# EAGLE schematic mainboard (EAGLE 9.1.1)
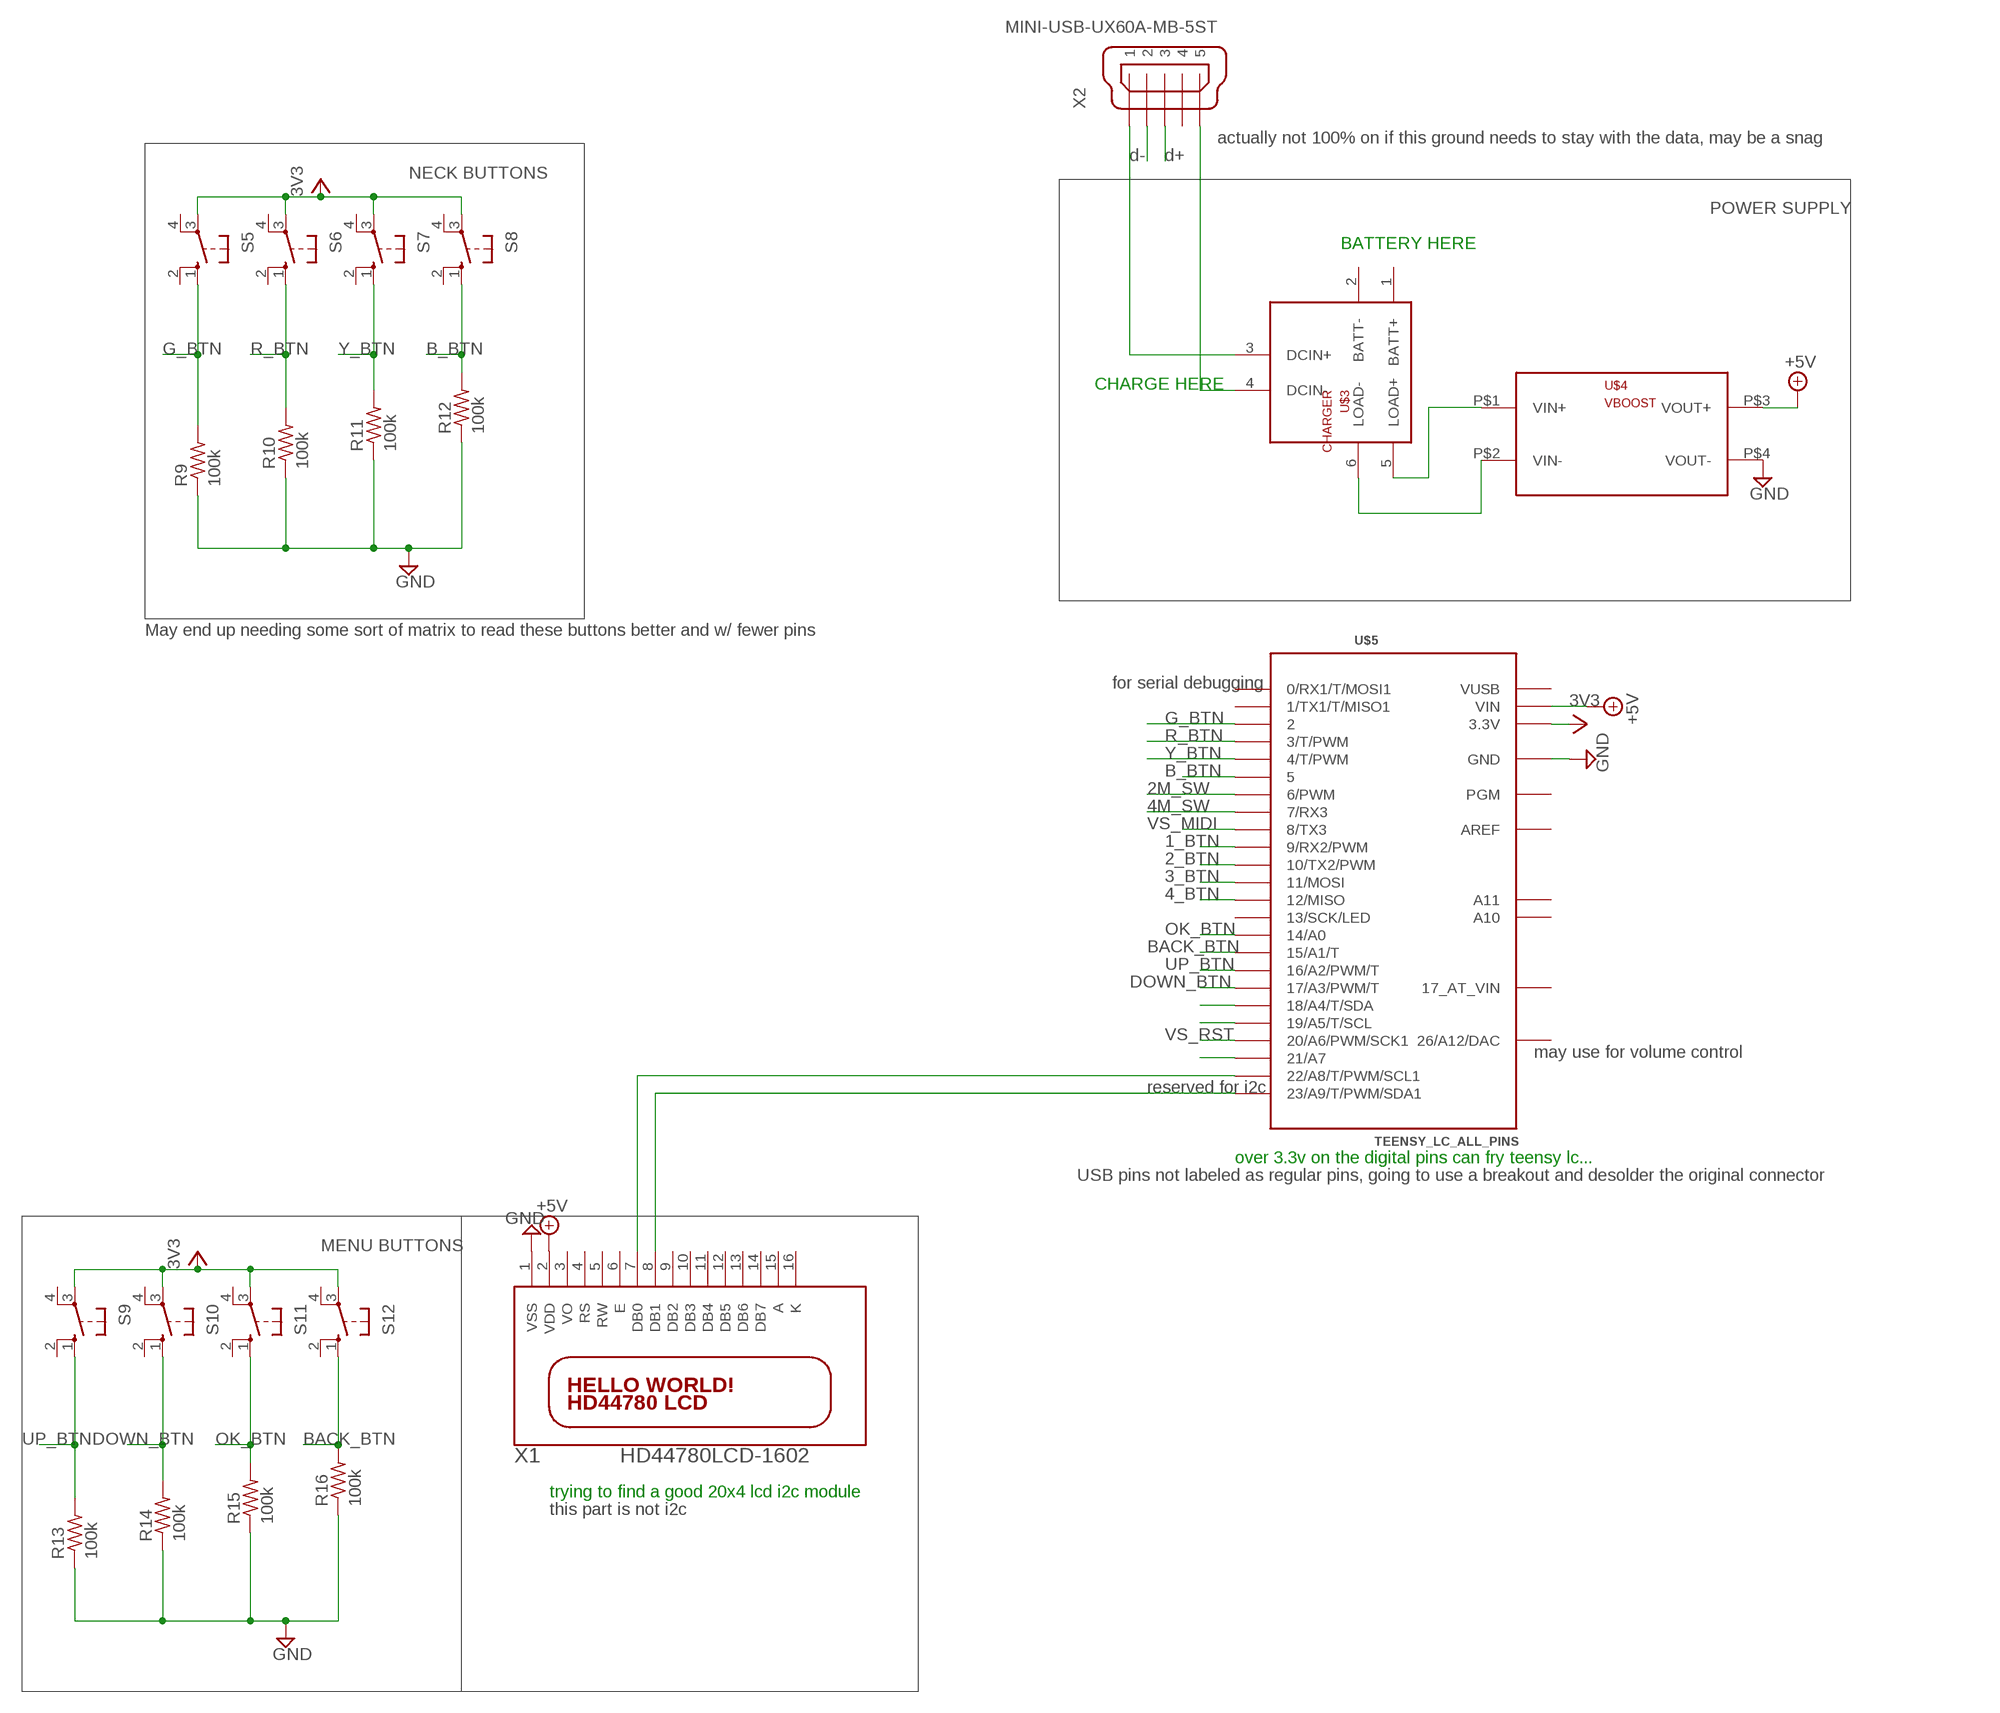
[diagram p0: schematic, sheet 1, part 1 of 2]
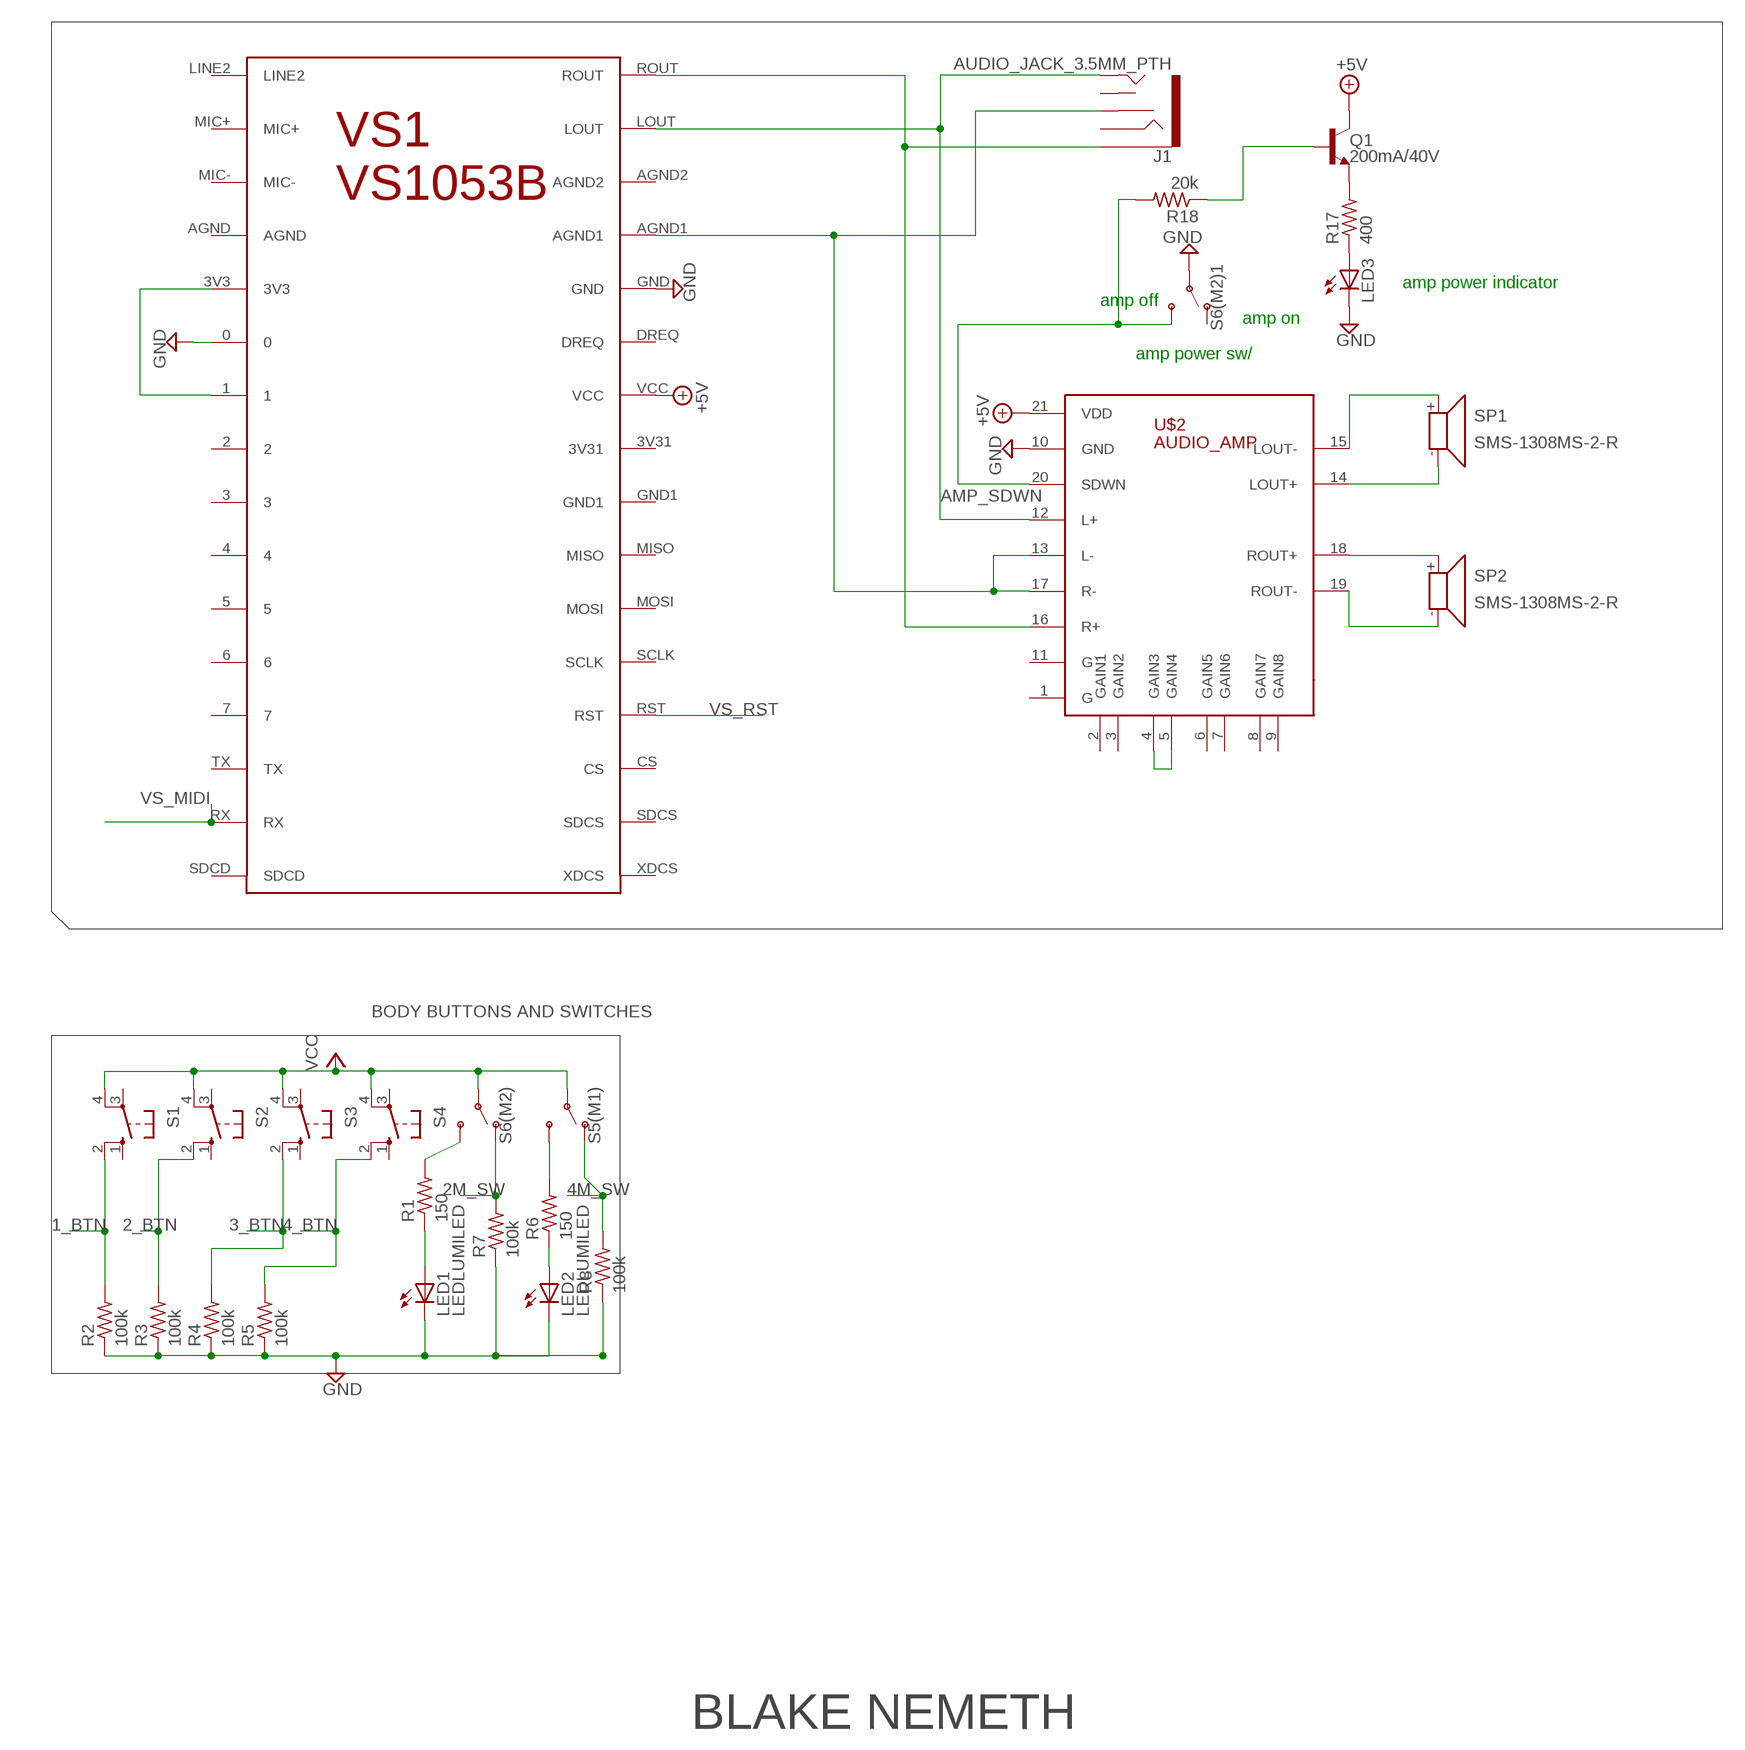
[diagram p1: schematic, sheet 1, part 2 of 2]

## Parts
J1  AUDIO_JACK_3.5MM_PTH  [AUDIO-JACK]
LED1  LEDLUMILED  [LUMILED]
LED2  LEDLUMILED  [LUMILED]
LED3  LED5MM  [LED5MM]
Q1  200mA/40V  TRANS_NPN-2N3904  [TO-92]
R1  150  R-US_0204/7  [0204/7]
R2  100k  R-US_0204/7  [0204/7]
R3  100k  R-US_0204/7  [0204/7]
R4  100k  R-US_0204/7  [0204/7]
R5  100k  R-US_0204/7  [0204/7]
R6  150  R-US_0204/7  [0204/7]
R7  100k  R-US_0204/7  [0204/7]
R8  100k  R-US_0204/7  [0204/7]
R9  100k  R-US_0204/7  [0204/7]
R10  100k  R-US_0204/7  [0204/7]
R11  100k  R-US_0204/7  [0204/7]
R12  100k  R-US_0204/7  [0204/7]
R13  100k  R-US_0204/7  [0204/7]
R14  100k  R-US_0204/7  [0204/7]
R15  100k  R-US_0204/7  [0204/7]
R16  100k  R-US_0204/7  [0204/7]
R17  400  R-US_0204/7  [0204/7]
R18  20k  R-US_0204/7  [0204/7]
S1  10-XX  [B3F-10XX]
S2  10-XX  [B3F-10XX]
S3  10-XX  [B3F-10XX]
S4  10-XX  [B3F-10XX]
S5  10-XX  [B3F-10XX]
S5(M1)  SWITCH-SPDT-PTH-11.6X4.0MM  [SWITCH_SPDT_PTH_11.6X4.0MM]
S6  10-XX  [B3F-10XX]
S6(M2)  SWITCH-SPDT-PTH-11.6X4.0MM  [SWITCH_SPDT_PTH_11.6X4.0MM]
S6(M2)1  SWITCH-SPDT-PTH-11.6X4.0MM  [SWITCH_SPDT_PTH_11.6X4.0MM]
S7  10-XX  [B3F-10XX]
S8  10-XX  [B3F-10XX]
S9  10-XX  [B3F-10XX]
S10  10-XX  [B3F-10XX]
S11  10-XX  [B3F-10XX]
S12  10-XX  [B3F-10XX]
SP1  SMS-1308MS-2-R  [SMS-1308MS-2-R]
SP2  SMS-1308MS-2-R  [SMS-1308MS-2-R]
U$2  AUDIO_AMP  [AUDIO_AMP]
U$3  CHARGER  [CHARGER]
U$4  VBOOST  [VBOOST]
U$5  TEENSY_LC_ALL_PINS  [TEENSY_3.0-3.2&LC_ALL_PINS]
VS1  VS1053B  [VS1053B]
X1  HD44780LCD-1602  [LCD1602]
X2  MINI-USB-UX60A-MB-5ST  [UX60A-MB-5ST]

## Nets
1_BTN: R2.2 S1.2(S1) U$5.9(9/RX2/PWM)
2_BTN: R3.2 S2.2(S1) U$5.10(10/TX2/PWM)
2M_SW: R7.2 S6(M2).1(O) U$5.6(6/PWM)
3_BTN: R4.2 S3.2(S1) U$5.11(11/MOSI)
4_BTN: R5.2 S4.2(S1) U$5.12(12/MISO)
4M_SW: R8.2 S5(M1).1(O) U$5.7(7/RX3)
+5V: U$2.21(VDD) U$4.P$3(VOUT+) U$5.VIN VS1.VCC
AMP_SDWN: R18.2 S6(M2)1.3(S) U$2.20(SDWN)
B_BTN: R12.2 S8.1(S) U$5.5
BACK_BTN: R16.2 S12.1(S) U$5.15/A1(15/A1/T)
DOWN_BTN: R14.2 S10.1(S) U$5.17/A3(17/A3/PWM/T)
G_BTN: R9.2 S5.1(S) U$5.2
GND: LED1.4-(C) LED2.4-(C) R2.1 R3.1 R4.1 R5.1 R7.1 R8.1 R9.1 R10.1 R11.1 R12.1 R13.1 R14.1 R15.1 R16.1 S6(M2)1.2(P) U$2.10(GND) U$4.P$4(VOUT-) U$5.AGND(GND) U$5.GND U$5.GND1(GND) VS1.0 VS1.GND
N$1: U$5.21/A7
N$2: X2.2
N$3: X2.3
N$4: U$3.3(DCIN+) X2.1
N$5: U$3.4(DCIN-) X2.5
N$6: U$5.22/A8(22/A8/T/PWM/SCL1) X1.7(DB0)
N$7: R6.2 S5(M1).3(S)
N$8: U$5.23/A9(23/A9/T/PWM/SDA1) X1.8(DB1)
N$9: LED3.A R17.1
N$10: Q1.1(E) R17.2
N$11: R1.2 S6(M2).3(S)
N$12: U$3.5(LOAD+) U$4.P$1(VIN+)
N$14: U$5.19/A5(19/A5/T/SCL)
N$15: U$3.6(LOAD-) U$4.P$2(VIN-)
N$16: LED2.2+(A) R6.1
N$17: U$5.18/A4(18/A4/T/SDA)
N$18: Q1.2(B) R18.1
N$19: LED1.2+(A) R1.1
N$22: VS1.1 VS1.3V3
N$25: J1.TIP U$2.12(L+) VS1.LOUT
N$26: J1.SLEEVE U$2.16(R+) VS1.ROUT
N$27: SP2.+ U$2.18(ROUT+)
N$28: SP2.- U$2.19(ROUT-)
N$29: SP1.- U$2.14(LOUT+)
N$30: SP1.+ U$2.15(LOUT-)
N$32: J1.RSH U$2.13(L-) U$2.17(R-) VS1.AGND1
N$36: U$2.4(GAIN3) U$2.5(GAIN4)
OK_BTN: R15.2 S11.1(S) U$5.14/A0
R_BTN: R10.2 S6.1(S) U$5.3(3/T/PWM)
UP_BTN: R13.2 S9.1(S) U$5.16/A2(16/A2/PWM/T)
VCC: S1.4(P1) S2.4(P1) S3.4(P1) S4.4(P1) S5(M1).2(P) S5.3(P) S6(M2).2(P) S6.3(P) S7.3(P) S8.3(P) S9.3(P) S10.3(P) S11.3(P) S12.3(P) U$5.3.3V U$5.3.3V1(3.3V) ; supply symbol labelled 3V3
VDD: X1.2(VDD) ; supply symbol labelled +5V
VS_MIDI: U$5.8(8/TX3) VS1.RX
VS_RST: U$5.20/A6(20/A6/PWM/SCK1) VS1.RST
VSS: X1.1(VSS) ; supply symbol labelled GND
Y_BTN: R11.2 S7.1(S) U$5.4(4/T/PWM)
Unconnected: J1.RING J1.TSH LED3.K(C) Q1.3(C) S1.1(S) S1.3(P) S2.1(S) S2.3(P) S3.1(S) S3.3(P) S4.1(S) S4.3(P) S5.2(S1) S5.4(P1) S6(M2)1.1(O) S6.2(S1) S6.4(P1) S7.2(S1) S7.4(P1) S8.2(S1) S8.4(P1) S9.2(S1) S9.4(P1) S10.2(S1) S10.4(P1) S11.2(S1) S11.4(P1) S12.2(S1) S12.4(P1) U$2.1(G) U$2.2(GAIN1) U$2.3(GAIN2) U$2.6(GAIN5) U$2.7(GAIN6) U$2.8(GAIN7) U$2.9(GAIN8) U$2.11(G`) U$3.1(BATT+) U$3.2(BATT-) U$5.0(0/RX1/T/MOSI1) U$5.1(1/TX1/T/MISO1) U$5.13(13/SCK/LED) U$5.A10 U$5.A11 U$5.PGM U$5.VBAT(17_AT_VIN) VS1.2 VS1.3 VS1.3V31 VS1.4 VS1.5 VS1.6 VS1.7 VS1.AGND VS1.AGND2 VS1.CS VS1.DREQ VS1.GND1 VS1.LINE2 VS1.MIC+ VS1.MIC- VS1.MISO VS1.MOSI VS1.SCLK VS1.SDCD VS1.SDCS VS1.TX VS1.XDCS X1.3(VO) X1.4(RS) X1.5(RW) X1.6(E) X1.9(DB2) X1.10(DB3) X1.11(DB4) X1.12(DB5) X1.13(DB6) X1.14(DB7) X1.15(A) X1.16(K) X2.4

## Notes on the sheet
- actually not 100% on if this ground needs to stay with the data, may be a snag
- d- | d+
- NECK BUTTONS
- POWER SUPPLY
- BATTERY HERE
- CHARGE HERE | amp power indicator
- amp off
- amp on
- amp power sw/
- May end up needing some sort of matrix to read these buttons better and w/ fewer pins
- for serial debugging
- may use for volume control
- reserved for i2c
- BODY BUTTONS AND SWITCHES
- over 3.3v on the digital pins can fry teensy lc...
- USB pins not labeled as regular pins, going to use a breakout and desolder the original connector
- MENU BUTTONS
- trying to find a good 20x4 lcd i2c module
- this part is not i2c
- BLAKE NEMETH

## Power pins joined to a net without a drawn wire
26/A12/DAC: U$5.RESET/DAC(26/A12/DAC)
AREF: U$5.AREF
VUSB: U$5.VUSB

## Library data of the parts
J1 = SparkFun-Connectors:AUDIO_JACK_3.5MM: Audio Jack 3.5mm variants of PTH and SMT stereo audio jack with bypass switches. SparkFun Products: SparkFun SparkPunk Sound Kit <[https://www.sparkfun.com/products/11177]> - PTH MP3 Trigger <https://www.sparkfun.com/products/13720> -3.5mm SMD SparkFun PicoBoard <https://www.sparkfun.com/products/11888>- 2.5mm SMD; PROD_ID: CONN-08774; SF_ID: PRT-08032
LED1 LED2 = led-lumiled:LED: LED; OC_FARNELL: unknown; OC_NEWARK: unknown
LED3 = led:LED: LED
Q1 = SparkFun-DiscreteSemi:TRANS_NPN: NPN transistor Current controlled devices typically used to amplify current or used as a switch. BC547 - COM-08928 <http://www.sparkfun.com/products/8928> (TO-92 45V 100mA) (1.Collector 2.Base 3.Emitter) 2N3904 - COM-00521 <http://www.sparkfun.com/products/521> (TO-92 40V 200mA) (1.Emitter 2.Base 3.Collector) P2N2222A - COM-12852 <http://www.sparkfun.com/products/12852> (TO-92 40V 600mA) (1.Collector 2.Base 3.Emitter); PROD_ID: TRANS-08447
R1-R18 = rcl:R-US_: RESISTOR, American symbol; SPICEPREFIX: R
S1-S12 = switch-omron:10-XX: OMRON SWITCH; MPN: B3F-1000; OC_FARNELL: 176432; OC_NEWARK: 36M3542
S5(M1) S6(M2) S6(M2)1 = SparkFun-Switches:SWITCH-SPDT: Single Pole, Double Throw (SPDT) Switch Single-pole, double-throw (SPDT) switch. Variant Overview SMD-AYZ0202 Surface Mount DPDT Switch <https://www.sparkfun.com/products/597> (COM-00597) Used on e.g. LilyPad Arduino USB - ATmega32U4 Board <https://www.sparkfun.com/products/12049> PTH-11.6X4.0MM SPDT Mini Power Switch <https://www.sparkfun.com/products/102> (COM-00102) Used on e.g. SparkFun Simon Says - Through-Hole Soldering Kit <https://www.sparkfun.com/products/10547> (KIT-10547) PTH-11.6X4.0MM-KIT KIT version of SPDT Mini Power Switch - Simplifies soldering by removing tStop of switch pins - only one side can be soldered. PTH-11.6X4.0MM-LOCK LOCK version of SPDT Mini Power Switch - Offset pins hold switch in place for easier soldering. SMD-RIGHT-ANGLE Surface Mount Right Angle Switch <https://www.sparkfun.com/products/10860> (COM-10860) Used on e.g. SparkFun ESP8266 Thing <https://www.sparkfun.com/products/13231>; PROD_ID: SWCH-08261; SF_SKU: COM-00102
SP1 SP2 = speaker:SMS-1308MS-2-R: Speaker 13 x 13mm, 8 Ohm, 0.7W Source: pui audio inc. SMS-1308MS-2-R.pdf
U$2 = synthtar:AUDIO_AMP
U$3 = synthtar:CHARGER
U$4 = synthtar:VBOOST
U$5 = Teensy_3_and_LC_Series_Boards_v1.4:TEENSY_LC_ALL_PINS: Teensy LC board with all pins used.
VS1 = synthtar:VS1053B
X1 = adafruit:HD44780LCD: HD44780 LCD Standard character type LCDs, available in sizes from 8x1 to 40x4!
X2 = con-hirose:MINI-USB-: MINI USB Connector Source: http://www.hirose.co.jp/cataloge_hp/e24000019.pdf; OC_FARNELL: unknown; OC_NEWARK: unknown